# EAGLE schematic vera-module (EAGLE 7.7.0)

## Sheet 1 of 2
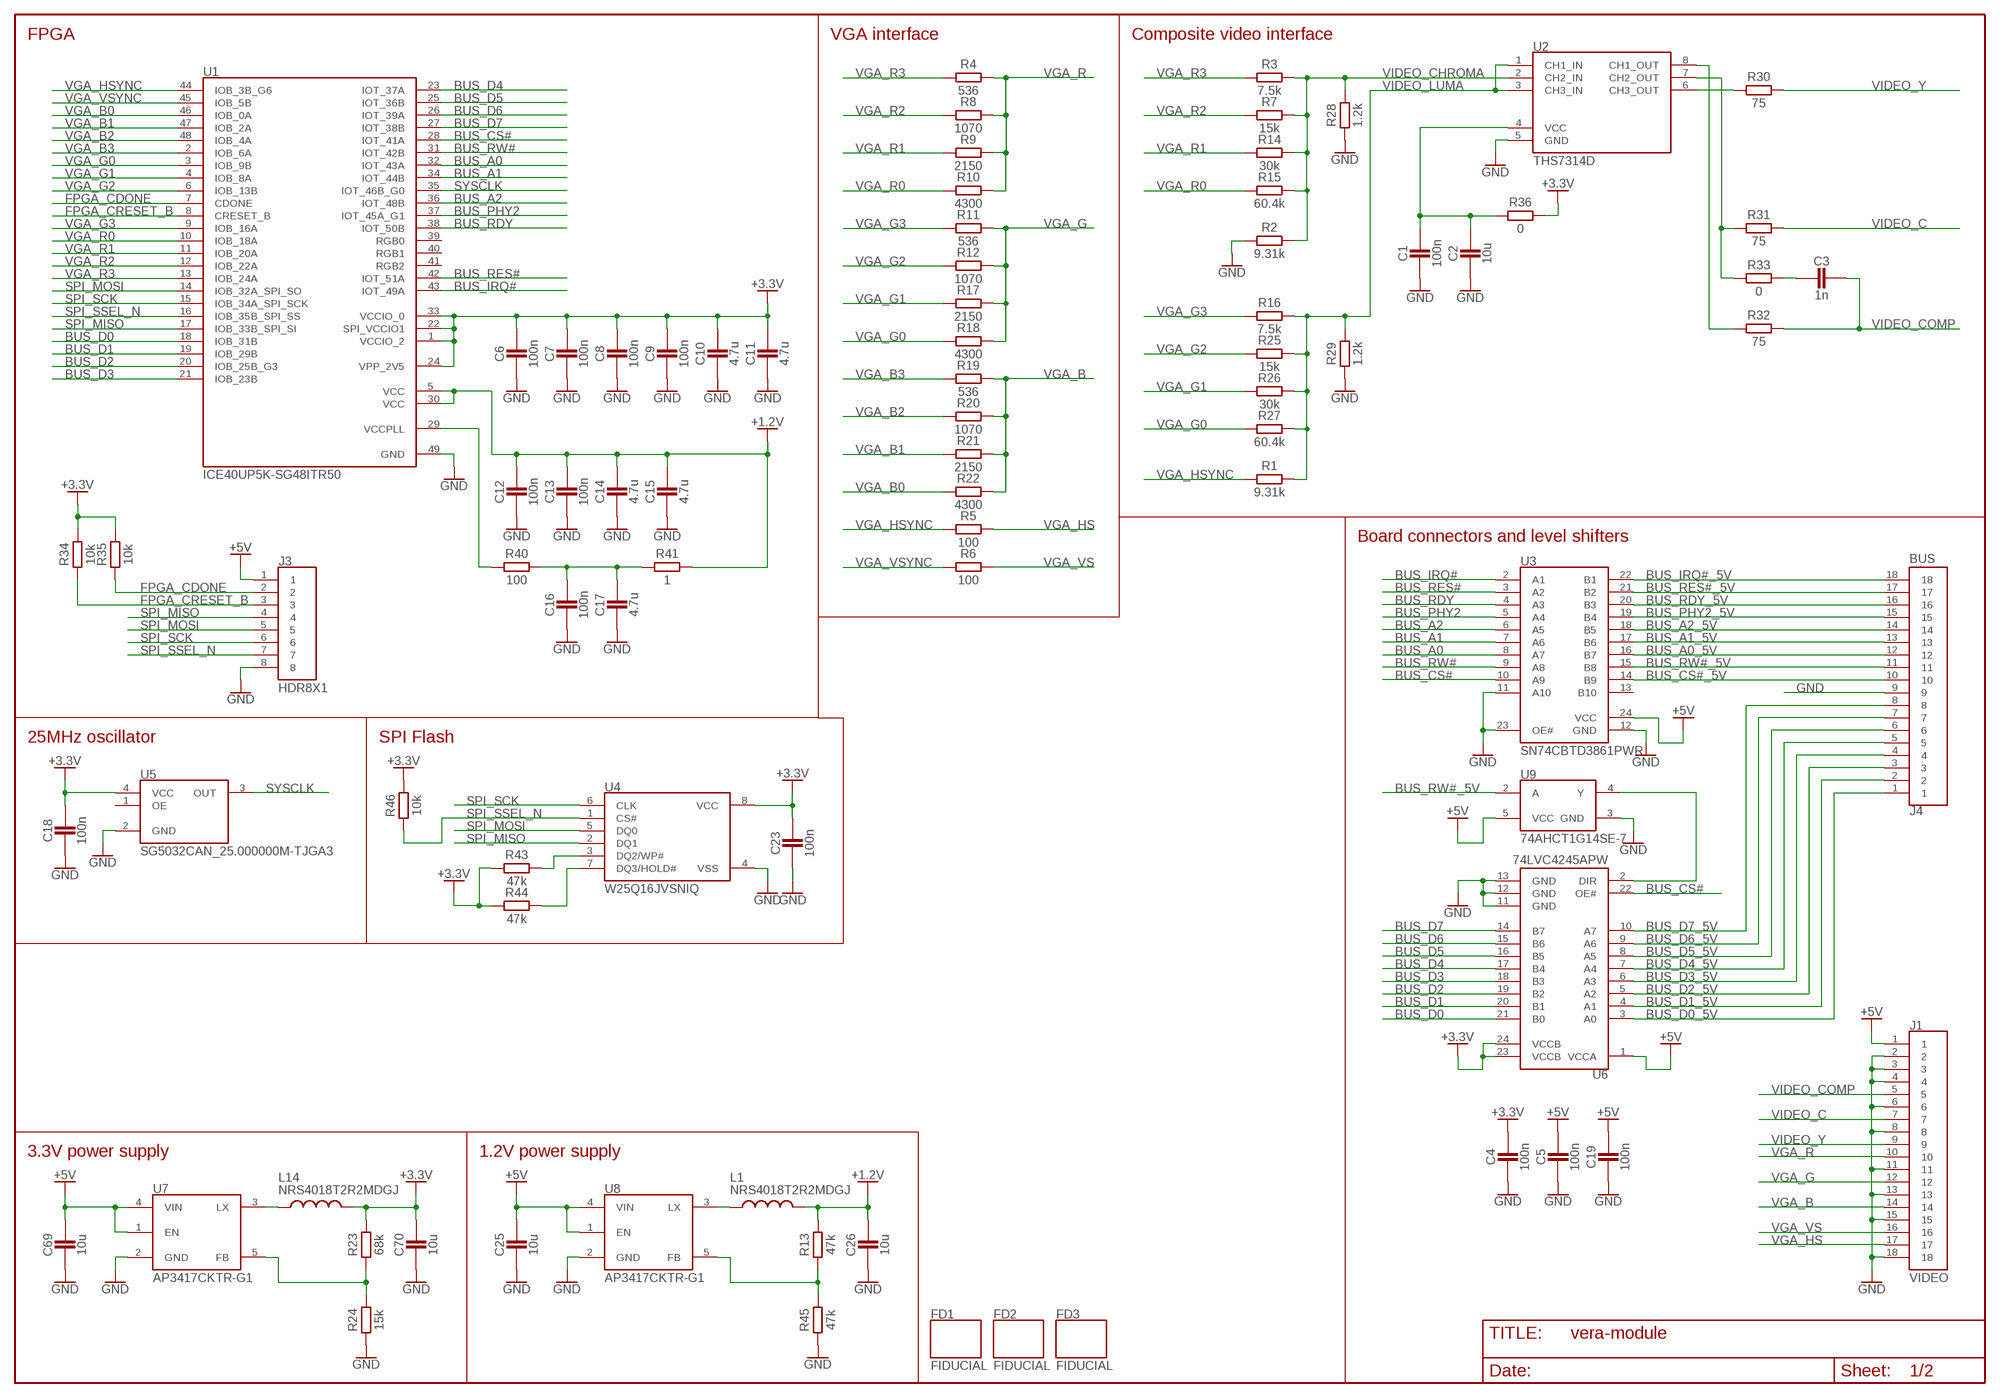
[diagram p0: schematic, sheet 1]

### Parts
C1  100n  CAPACITOR0603  [C0603]
C2  10u  CAPACITOR0805  [C0805]
C3  1n  CAPACITOR0603  [C0603]
C4  100n  CAPACITOR0603  [C0603]
C5  100n  CAPACITOR0603  [C0603]
C6  100n  CAPACITOR0603  [C0603]
C7  100n  CAPACITOR0603  [C0603]
C8  100n  CAPACITOR0603  [C0603]
C9  100n  CAPACITOR0603  [C0603]
C10  4.7u  CAPACITOR0603  [C0603]
C11  4.7u  CAPACITOR0603  [C0603]
C12  100n  CAPACITOR0603  [C0603]
C13  100n  CAPACITOR0603  [C0603]
C14  4.7u  CAPACITOR0603  [C0603]
C15  4.7u  CAPACITOR0603  [C0603]
C16  100n  CAPACITOR0603  [C0603]
C17  4.7u  CAPACITOR0603  [C0603]
C18  100n  CAPACITOR0603  [C0603]
C19  100n  CAPACITOR0603  [C0603]
C23  100n  CAPACITOR0603  [C0603]
C25  10u  CAPACITOR0805  [C0805]
C26  10u  CAPACITOR0805  [C0805]
C69  10u  CAPACITOR0805  [C0805]
C70  10u  CAPACITOR0805  [C0805]
FD1  FIDUCIAL  [FIDUCIAL]
FD2  FIDUCIAL  [FIDUCIAL]
FD3  FIDUCIAL  [FIDUCIAL]
J1  VIDEO  HDR18X1  [HDR18X1]
J3  HDR8X1  [HDR8X1]
J4  BUS  HDR18X1  [HDR18X1]
L1  NRS4018T2R2MDGJ  INDUCTORNRS4018  [NRS4018]
L14  NRS4018T2R2MDGJ  INDUCTORNRS4018  [NRS4018]
R1  9.31k  RESISTOR0603  [R0603]
R2  9.31k  RESISTOR0603  [R0603]
R3  7.5k  RESISTOR0603  [R0603]
R4  536  RESISTOR0603  [R0603]
R5  100  RESISTOR0603  [R0603]
R6  100  RESISTOR0603  [R0603]
R7  15k  RESISTOR0603  [R0603]
R8  1070  RESISTOR0603  [R0603]
R9  2150  RESISTOR0603  [R0603]
R10  4300  RESISTOR0603  [R0603]
R11  536  RESISTOR0603  [R0603]
R12  1070  RESISTOR0603  [R0603]
R13  47k  RESISTOR0603  [R0603]
R14  30k  RESISTOR0603  [R0603]
R15  60.4k  RESISTOR0603  [R0603]
R16  7.5k  RESISTOR0603  [R0603]
R17  2150  RESISTOR0603  [R0603]
R18  4300  RESISTOR0603  [R0603]
R19  536  RESISTOR0603  [R0603]
R20  1070  RESISTOR0603  [R0603]
R21  2150  RESISTOR0603  [R0603]
R22  4300  RESISTOR0603  [R0603]
R23  68k  RESISTOR0603  [R0603]
R24  15k  RESISTOR0603  [R0603]
R25  15k  RESISTOR0603  [R0603]
R26  30k  RESISTOR0603  [R0603]
R27  60.4k  RESISTOR0603  [R0603]
R28  1.2k  RESISTOR0603  [R0603]
R29  1.2k  RESISTOR0603  [R0603]
R30  75  RESISTOR0603  [R0603]
R31  75  RESISTOR0603  [R0603]
R32  75  RESISTOR0603  [R0603]
R33  0  RESISTOR0603  [R0603]
R34  10k  RESISTOR0603  [R0603]
R35  10k  RESISTOR0603  [R0603]
R36  0  RESISTOR0603  [R0603]
R40  100  RESISTOR0603  [R0603]
R41  1  RESISTOR0603  [R0603]
R43  47k  RESISTOR0603  [R0603]
R44  47k  RESISTOR0603  [R0603]
R45  47k  RESISTOR0603  [R0603]
R46  10k  RESISTOR0603  [R0603]
U1  ICE40UP5K-SG48ITR50  [QFN-48]
U2  THS7314D  [SOIC-8]
U3  SN74CBTD3861PWR  [TSSOP-24]
U4  W25Q16JVSNIQ  QSPI_FLASHSOIC8  [SOIC-8]
U5  SG5032CAN_25.000000M-TJGA3  SG5032CAN_40.000000M-TJGA3  [SG5032]
U6  74LVC4245APW  [TSSOP-24]
U7  AP3417CKTR-G1  [SOT-23-5]
U8  AP3417CKTR-G1  [SOT-23-5]
U9  74AHCT1G14SE-7  [TSSOP-5]

### Nets
+1.2V: C12.2 C13.2 C14.2 C15.2 C26.2 L1.2 R13.2 R41.2 U1.5(VCC) U1.30(VCC)
+3.3V: C4.2 C6.2 C7.2 C8.2 C9.2 C10.2 C11.2 C18.2 C23.2 C70.2 L14.2 R23.2 R34.1 R35.1 R36.2 R43.1 R44.1 R46.1 U1.1(VCCIO_2) U1.22(SPI_VCCIO1) U1.24(VPP_2V5) U1.33(VCCIO_0) U4.8(VCC) U5.4(VCC) U6.23(VCCB) U6.24(VCCB)
+5V [5V]: C5.2 C19.2 C25.2 C69.2 J1.1 J3.1 U3.24(VCC) U6.1(VCCA) U7.1(EN) U7.4(VIN) U8.1(EN) U8.4(VIN) U9.5(VCC) ; also sheet 2
BUS_A0: U1.32(IOT_43A) U3.8(A7)
BUS_A0_5V: J4.12 U3.16(B7)
BUS_A1: U1.34(IOT_44B) U3.7(A6)
BUS_A1_5V: J4.13 U3.17(B6)
BUS_A2: U1.36(IOT_48B) U3.6(A5)
BUS_A2_5V: J4.14 U3.18(B5)
BUS_CS#: U1.28(IOT_41A) U3.10(A9) U6.22(OE#)
BUS_CS#_5V: J4.10 U3.14(B9)
BUS_D0: U1.18(IOB_31B) U6.21(B0)
BUS_D0_5V: J4.1 U6.3(A0)
BUS_D1: U1.19(IOB_29B) U6.20(B1)
BUS_D1_5V: J4.2 U6.4(A1)
BUS_D2: U1.20(IOB_25B_G3) U6.19(B2)
BUS_D2_5V: J4.3 U6.5(A2)
BUS_D3: U1.21(IOB_23B) U6.18(B3)
BUS_D3_5V: J4.4 U6.6(A3)
BUS_D4: U1.23(IOT_37A) U6.17(B4)
BUS_D4_5V: J4.5 U6.7(A4)
BUS_D5: U1.25(IOT_36B) U6.16(B5)
BUS_D5_5V: J4.6 U6.8(A5)
BUS_D6: U1.26(IOT_39A) U6.15(B6)
BUS_D6_5V: J4.7 U6.9(A6)
BUS_D7: U1.27(IOT_38B) U6.14(B7)
BUS_D7_5V: J4.8 U6.10(A7)
BUS_IRQ#: U1.43(IOT_49A) U3.2(A1)
BUS_IRQ#_5V: J4.18 U3.22(B1)
BUS_PHY2: U1.37(IOT_45A_G1) U3.5(A4)
BUS_PHY2_5V: J4.15 U3.19(B4)
BUS_RDY: U1.38(IOT_50B) U3.4(A3)
BUS_RDY_5V: J4.16 U3.20(B3)
BUS_RES#: U1.42(IOT_51A) U3.3(A2)
BUS_RES#_5V: J4.17 U3.21(B2)
BUS_RW#: U1.31(IOT_42B) U3.9(A8)
BUS_RW#_5V: J4.11 U3.15(B8) U9.2(A)
FPGA_CDONE: J3.2 R35.2 U1.7(CDONE) ; also sheet 2
FPGA_CRESET_B: J3.3 R34.2 U1.8(CRESET_B) ; also sheet 2
GND: C1.1 C2.1 C4.1 C5.1 C6.1 C7.1 C8.1 C9.1 C10.1 C11.1 C12.1 C13.1 C14.1 C15.1 C16.1 C17.1 C18.1 C19.1 C23.1 C25.1 C26.1 C69.1 C70.1 J1.2 J1.3 J1.4 J1.6 J1.8 J1.11 J1.13 J1.15 J1.18 J3.8 J4.9 R2.1 R24.1 R28.2 R29.2 R45.1 U1.49(GND) U2.5(GND) U3.11(A10) U3.12(GND) U3.23(OE#) U4.4(VSS) U5.2(GND) U6.11(GND) U6.12(GND) U6.13(GND) U7.2(GND) U8.2(GND) U9.3(GND) ; also sheet 2
N$1: R30.1 U2.6(CH3_OUT)
N$2: R31.1 R33.1 U2.7(CH2_OUT)
N$4: R32.1 U2.8(CH1_OUT)
N$6: C3.1 R33.2
N$7: R23.1 R24.2 U7.5(FB)
N$8: U6.2(DIR) U9.4(Y)
N$9: C16.2 C17.2 R40.2 R41.1
N$14: R43.2 U4.3(DQ2/WP#)
N$15: R13.1 R45.2 U8.5(FB)
N$19: R44.2 U4.7(DQ3/HOLD#)
N$20: L1.1 U8.3(LX)
N$23: L14.1 U7.3(LX)
N$29: C1.2 C2.2 R36.1 U2.4(VCC)
N$44: R40.1 U1.29(VCCPLL)
SPI_MISO: J3.4 U1.17(IOB_33B_SPI_SI) U4.2(DQ1) ; also sheet 2
SPI_MOSI: J3.5 U1.14(IOB_32A_SPI_SO) U4.5(DQ0) ; also sheet 2
SPI_SCK: J3.6 U1.15(IOB_34A_SPI_SCK) U4.6(CLK) ; also sheet 2
SPI_SSEL_N: J3.7 R46.2 U1.16(IOB_35B_SPI_SS) U4.1(CS#) ; also sheet 2
SYSCLK: U1.35(IOT_46B_G0) U5.3(OUT)
VGA_B: J1.14 R19.2 R20.2 R21.2 R22.2
VGA_B0: R22.1 U1.46(IOB_0A)
VGA_B1: R21.1 U1.47(IOB_2A)
VGA_B2: R20.1 U1.48(IOB_4A)
VGA_B3: R19.1 U1.2(IOB_6A)
VGA_G: J1.12 R11.2 R12.2 R17.2 R18.2
VGA_G0: R18.1 R27.1 U1.3(IOB_9B)
VGA_G1: R17.1 R26.1 U1.4(IOB_8A)
VGA_G2: R12.1 R25.1 U1.6(IOB_13B)
VGA_G3: R11.1 R16.1 U1.9(IOB_16A)
VGA_HS: J1.17 R5.2
VGA_HSYNC: R1.1 R5.1 U1.44(IOB_3B_G6)
VGA_R: J1.10 R4.2 R8.2 R9.2 R10.2
VGA_R0: R10.1 R15.1 U1.10(IOB_18A)
VGA_R1: R9.1 R14.1 U1.11(IOB_20A)
VGA_R2: R7.1 R8.1 U1.12(IOB_22A)
VGA_R3: R3.1 R4.1 U1.13(IOB_24A)
VGA_VS: J1.16 R6.2
VGA_VSYNC: R6.1 U1.45(IOB_5B)
VIDEO_C: J1.7 R31.2
VIDEO_CHROMA: R2.2 R3.2 R7.2 R14.2 R15.2 R28.1 U2.2(CH2_IN)
VIDEO_COMP: C3.2 J1.5 R32.2
VIDEO_LUMA: R1.2 R16.2 R25.2 R26.2 R27.2 R29.1 U2.1(CH1_IN) U2.3(CH3_IN)
VIDEO_Y: J1.9 R30.2
Unconnected: U1.39(RGB0) U1.40(RGB1) U1.41(RGB2) U3.13(B10) U5.1(OE)

### Notes on the sheet
- FPGA | VGA interface | Composite video interface
- Board connectors and level shifters
- 25MHz oscillator | SPI Flash
- 3.3V power supply | 1.2V power supply

## Sheet 2 of 2
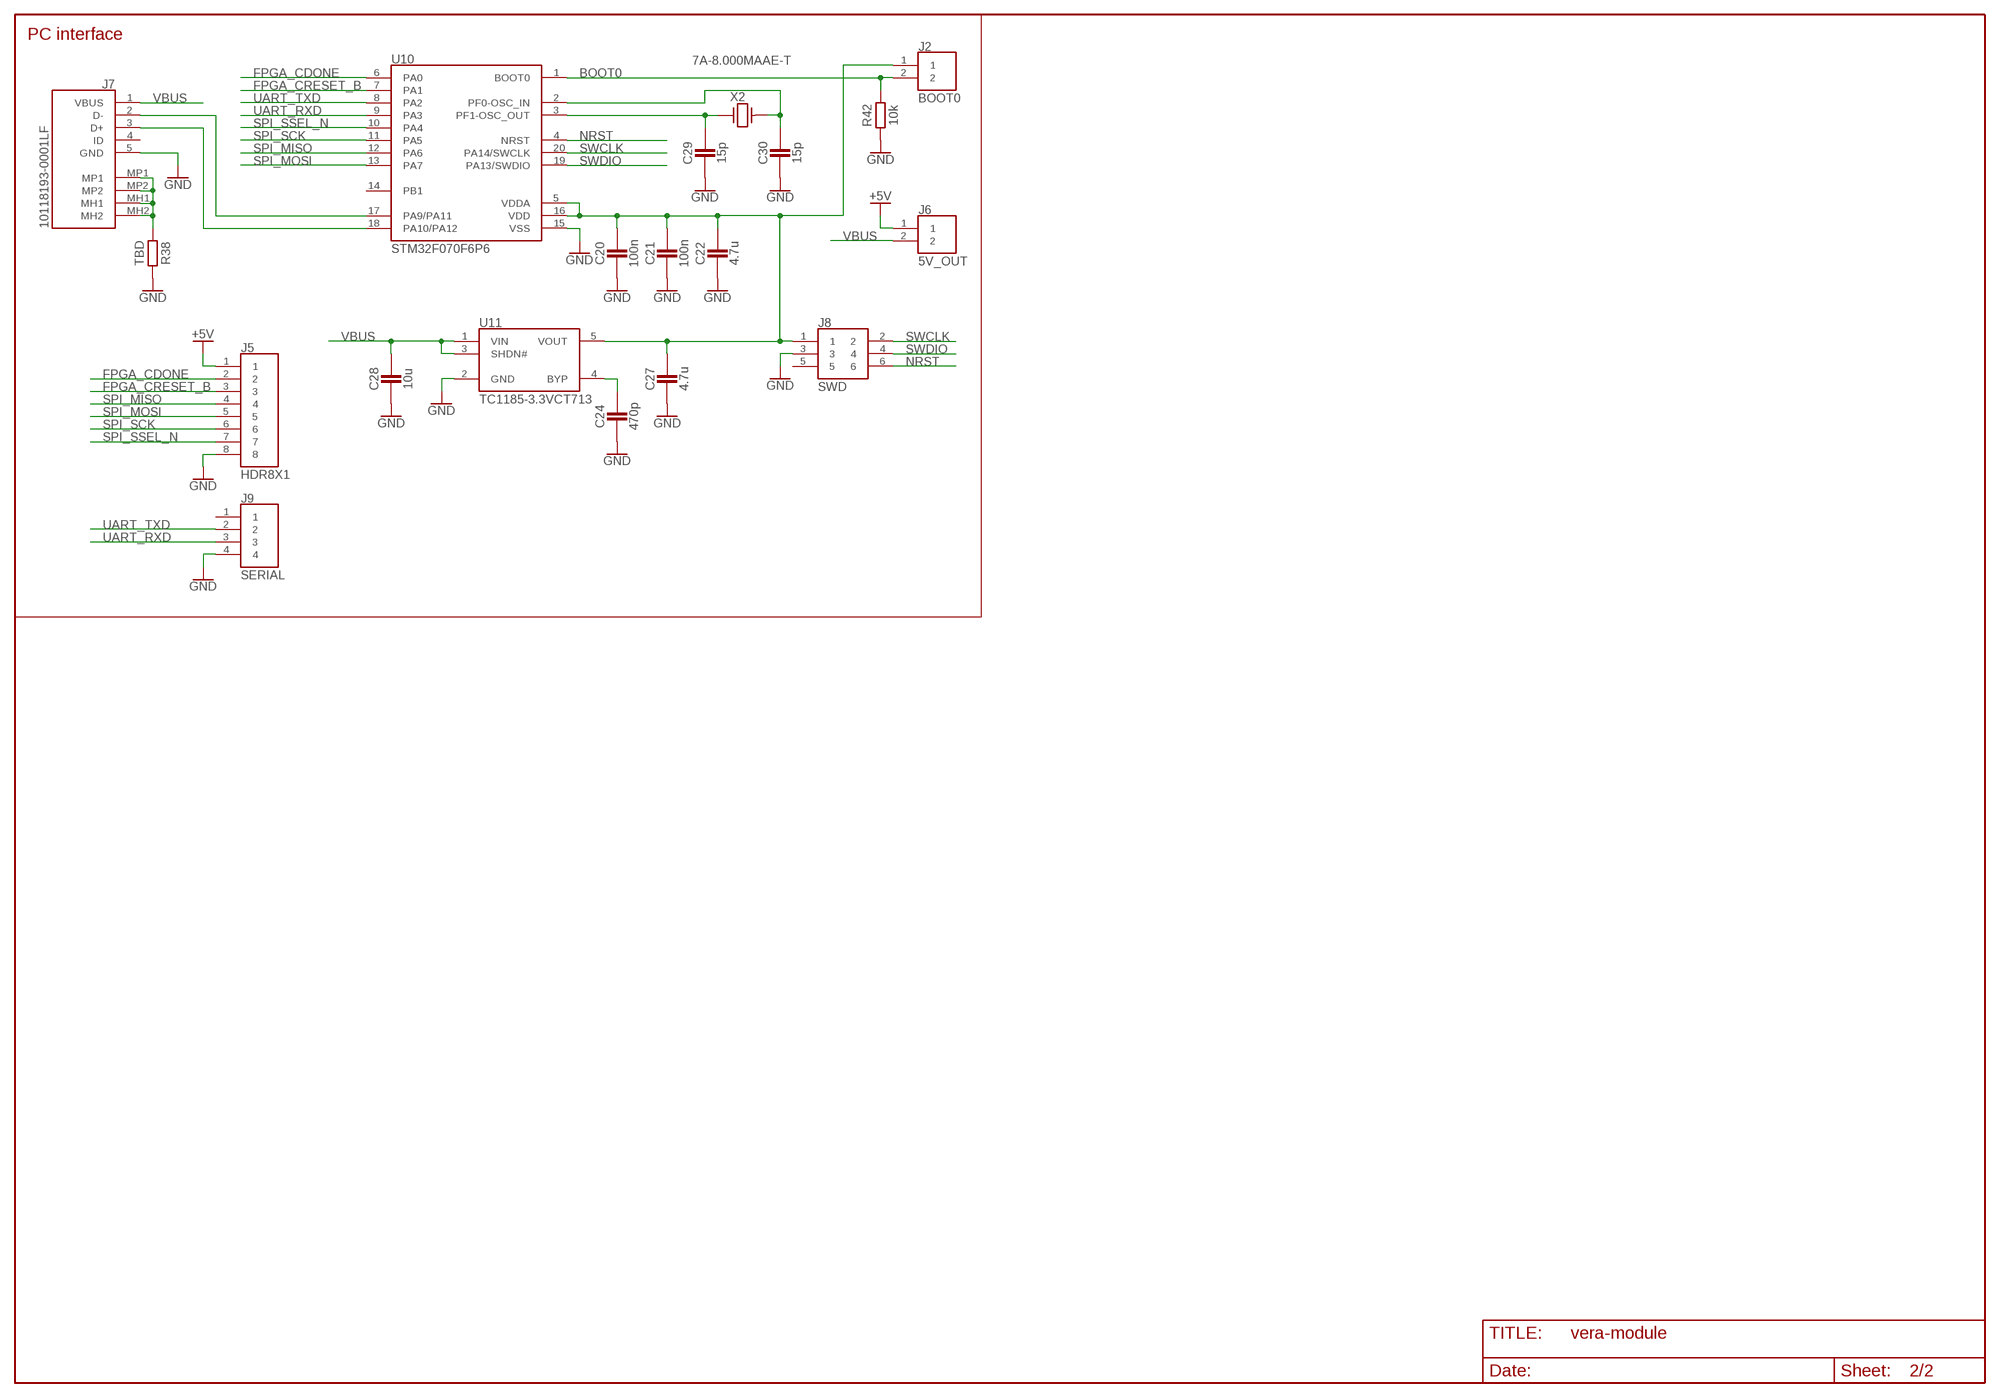
[diagram p1: schematic, sheet 2]

### Parts
C20  100n  CAPACITOR0603  [C0603]
C21  100n  CAPACITOR0603  [C0603]
C22  4.7u  CAPACITOR0603  [C0603]
C24  470p  CAPACITOR0603  [C0603]
C27  4.7u  CAPACITOR0603  [C0603]
C28  10u  CAPACITOR0805  [C0805]
C29  15p  CAPACITOR0603  [C0603]
C30  15p  CAPACITOR0603  [C0603]
J2  BOOT0  HDR2X1  [HDR2X1]
J5  HDR8X1  [HDR8X1]
J6  5V_OUT  HDR2X1  [HDR2X1]
J7  10118193-0001LF  [10118193-0001LF]
J8  SWD  HDR2X3  [HDR2X3]
J9  SERIAL  HDR4X1  [HDR4X1]
R38  TBD  RESISTOR0603  [R0603]
R42  10k  RESISTOR0603  [R0603]
U10  STM32F070F6P6  [TSSOP-20]
U11  TC1185-3.3VCT713  [SOT-23-5]
X2  7A-8.000MAAE-T  XTAL2_5X3.2  [XTAL2_5X3.2]

### Nets
+5V [5V]: J5.1 J6.1 ; also sheet 1
BOOT0: J2.2 R42.2 U10.1(BOOT0)
FPGA_CDONE: J5.2 U10.6(PA0) ; also sheet 1
FPGA_CRESET_B: J5.3 U10.7(PA1) ; also sheet 1
GND: C20.1 C21.1 C22.1 C24.1 C27.1 C28.1 C29.1 C30.1 J5.8 J7.5(GND) J8.3 J9.4 R38.1 R42.1 U10.15(VSS) U11.2(GND) ; also sheet 1
N$3: C29.2 U10.3(PF1-OSC_OUT) X2.1
N$5: C20.2 C21.2 C22.2 C27.2 J2.1 J8.1 U10.5(VDDA) U10.16(VDD) U11.5(VOUT)
N$10: C24.2 U11.4(BYP)
N$11: C30.2 U10.2(PF0-OSC_IN) X2.2
N$12: J7.2(D-) U10.17(PA9/PA11)
N$13: J7.3(D+) U10.18(PA10/PA12)
N$48: J7.MH1 J7.MH2 J7.MP1 J7.MP2 R38.2
NRST: J8.6 U10.4(NRST)
SPI_MISO: J5.4 U10.12(PA6) ; also sheet 1
SPI_MOSI: J5.5 U10.13(PA7) ; also sheet 1
SPI_SCK: J5.6 U10.11(PA5) ; also sheet 1
SPI_SSEL_N: J5.7 U10.10(PA4) ; also sheet 1
SWCLK: J8.2 U10.20(PA14/SWCLK)
SWDIO: J8.4 U10.19(PA13/SWDIO)
UART_RXD: J9.3 U10.9(PA3)
UART_TXD: J9.2 U10.8(PA2)
VBUS [5V]: C28.2 J6.2 J7.1(VBUS) U11.1(VIN) U11.3(SHDN#)
Unconnected: J7.4(ID) J8.5 J9.1 U10.14(PB1)

### Notes on the sheet
- PC interface

## Library data of the parts
C1-C30 C69 C70 = rcl:CAPACITOR
FD1-FD3 = misc:FIDUCIAL
J1 J4 = connectors:HDR18X1
J2 J6 = connectors:HDR2X1
J3 J5 = connectors:HDR8X1
J7 = connectors:10118193-0001LF
J8 = connectors:HDR2X3
J9 = connectors:HDR4X1
L1 L14 = rcl:INDUCTOR
R1-R36 R38 R40-R46 = rcl:RESISTOR
U1 = integrated_circuits:ICE40UP5K-SG48ITR50: Lattice ICE40 5K LE FPGA
U2 = integrated_circuits:THS7314D
U3 = integrated_circuits:SN74CBTD3861PWR
U4 = integrated_circuits:QSPI_FLASH
U5 = integrated_circuits:SG5032CAN_40.000000M-TJGA3: Epson 40 MHz 3.3V Oscillator +/- 50ppm
U6 = integrated_circuits:74LVC4245APW
U7 U8 = integrated_circuits:AP3417CKTR-G1
U9 = integrated_circuits:74AHCT1G14SE-7
U10 = integrated_circuits:STM32F070F6P6: ARM Cortex M0 with USB 32KB Flash, 6KB RAM
U11 = integrated_circuits:TC1185-3.3VCT713
X2 = crystals:XTAL2_5X3.2

## Net classes
1 5V: clearance 0.2 mm